# Altium schematic sheet MCU025A_XDS110_Target_Interface.SchDoc
size 431 x 279 mm; Date: Not shown in title block; ApprovedBy: Not shown in title block; CheckedBy: Not shown in title block; Author: Not shown in title block; CompanyName: Not shown in title block; Engineer: Not shown in title block; Organization: Not shown in title block; Address1: Not shown in title block; Address2: Not shown in title block; Address3: Not shown in title block; Address4: Not shown in title block; DocumentNumber: 5; Revision: Use project parameter SCH_Rev; SheetNumber: 5; SheetTotal: 8; PageSetup: Record=PageOptions|CenterHorizontal=True|CenterVertical=True|PrintScale=1.00|XCorrection=1.00|YCorrection=1.00|PrintKind=0|BorderSize=5000000|LeftOffset=0|BottomOffset=0|Orientation=2|PaperLength=1000|PaperWidth=1000|Scale=100|PaperSource=15|PrintQuality=600|MediaType=1|DitherType=10|PaperKind=Letter|PrintScaleMode=1; CurrentTime: Not shown in title block; CurrentDate: Not shown in title block; Time: Not shown in title block; DocumentFullPathAndName: Not shown in title block; DocumentName: Not shown in title block; ModifiedDate: Not shown in title block; ImagePath: Not shown in title block
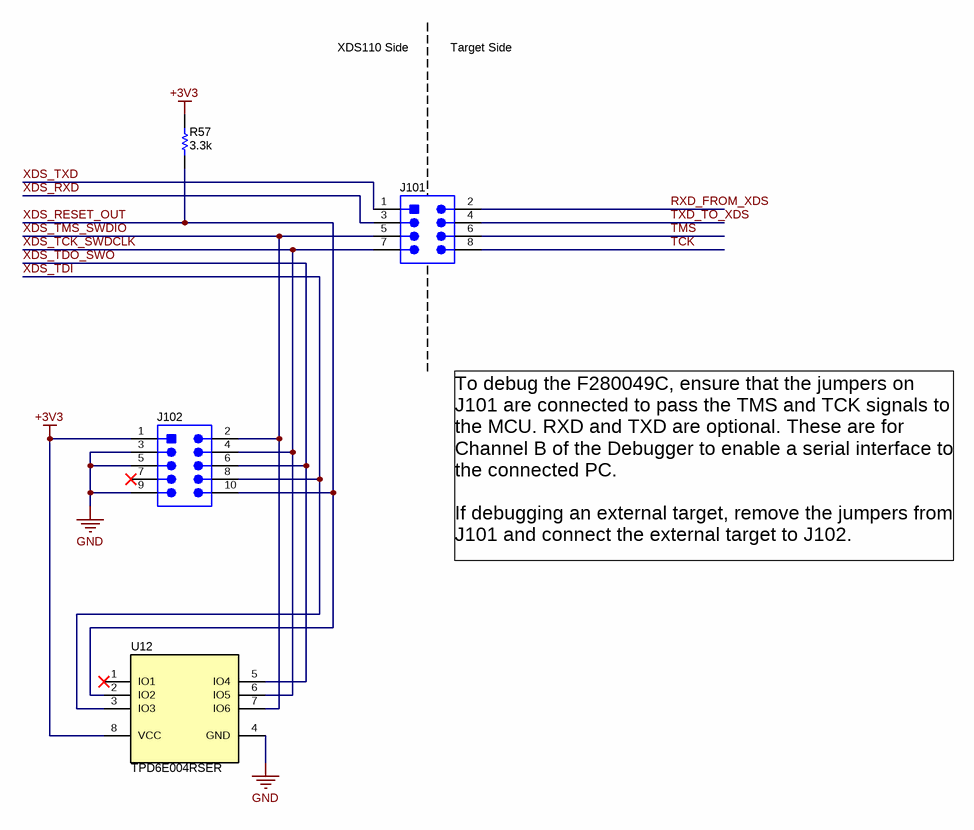
[diagram p0: MCU025A_XDS110_Target_Interface.SchDoc]

## Parts
J101  TSW-104-07-G-D  [TSW-104-07-G-D]  (value not drawn)
J102  FTSH-105-01-F-DV-K  [Samtec_FTSH-105-01-x-DV-K]  (value not drawn)
R57  ValueDisplayed: 3.3k  [0402]  (hidden comment: CRCW04023K30JNED)
U12  TPD6E004RSER  [RSE0008A]

## Nets
+3V3: J102.1 R57.2 U12.8(VCC)
GND: J102.3 J102.5 J102.9 U12.4(GND)
RXD_FROM_XDS: J101.2
TCK: J101.8
TMS: J101.6
TXD_TO_XDS: J101.4
XDS_RESET_OUT: J102.10 R57.1 U12.2(IO2)
XDS_RXD: J101.3
XDS_TCK_SWDCLK: J101.7 J102.4 U12.6(IO5)
XDS_TDI: J102.8 U12.3(IO3)
XDS_TDO_SWO: J102.6 U12.5(IO4)
XDS_TMS_SWDIO: J101.5 J102.2 U12.7(IO6)
XDS_TXD: J101.1

Not connected (* = marked no-connect by the designer): J102 7*; U12 1(IO1)*

## Notes on the sheet
- XDS110 Side
- Target Side
- To debug the F280049C, ensure that the jumpers on J101 are connected to pass the TMS and TCK signals to the MCU. RXD and TXD are optional. These are for Channel B of the Debugger to enable a serial interface to the connected PC.
  If debugging an external target, remove the jumpers from J101 and connect the external target to J102.
- Drawn By:
- SVN Rev:
- Number:
- TID #:
- Orderable:
- Rev:
- Sheet Title:
- File:
- Project Title:
- Designed for:
- Assembly Variant:
- Mod. Date:
- Sheet:
- Size:
- of
- B
- http://www.ti.com
- Texas Instruments and/or its licensors do not warrant the accuracy or completeness of this specification or any information contained therein. Texas Instruments and/or its licensors do not warrant that this design will meet the specifications, will be suitable for your application or fit for any particular purpose, or will operate in an implementation. Texas Instruments and/or its licensors do not warrant that the design is production worthy. You should completely validate and test your design implementation to confirm the system functionality for your application.
- Engineer:
- Contact:
- © Texas Instruments

## Library data of the parts
J101 = CMP-0075408-1: Header, 100mil, 4x2, Gold, TH; Manufacturer: Samtec; Pitch_mm: 2.54; Cert_VDE: N; Gender: Male; Cert_CSA: Y; Voltage_V: 550V; Green_REACh: Passed; Current_A: 6.3A; CT: False; Green_Lifecycle: Active; Row_Count: 2; CNHeader: True; ComponentLink1Description: Datasheet URL; RoHS: Y; Supplier 1: Digi-Key; Cert_UL: Y; Orientation: Vertical; Green_EU RoHS: Passed; PackageReference: 4x2 Header; Color: Black; PartNumber: TSW-104-07-G-D; PinCount: 8; Publisher: Texas Instruments; ContactFinish: Gold; Cert_CULUS: N; Shrouded: N; ClassName: Header; RowSpacing_mm: 2.54; ComponentLink1URL: http://samtec.com/ftppub/pdf/TSW_TH.PDF; LatestRevisionDate: 2017-07-12; CompType: Header; MountType: TH; Supplier Part Number 1: SAM1028-04-ND; Green_EU RoHS-2: Passed
J102 = CMP-0075670-1: Header (Shrouded), 1.27mm, 5x2, Gold, SMT; Manufacturer: Samtec; Pitch_mm: 1.27; Gender: Male; Shrouded: Y; Row_Count: 2; Current_A: 3.3A; CNHeader: False; PartNumber: FTSH-105-01-F-DV-K; PackageReference: Header(Shrouded), 1.27mm, 5x2, SMT; CompType: Header; RoHS: Y; MountType: SMT; ComponentLink1Description: Datasheet URL; ComponentLink1URL: http://suddendocs.samtec.com/prints/ftsh-1xx-xx-xxx-dv-xxx-mkt.pdf; Orientation: Vertical; PinCount: 10; RowSpacing_mm: 1.27; ContactFinish: Gold; Color: Black; Cert_CSA: Y; Cert_UL: Y; Publisher: Texas Instruments; LatestRevisionDate: 2017-07-12; Supplier 1: Digi-Key; Supplier Part Number 1: SAM8796-ND; Supplier 2: Newark; Supplier Part Number 2: 45P5160; CT: False
R57 = CMP-0026918-5: RES, 3.3 k, 5%, 0.063 W, AEC-Q200 Grade 0, 0402; Manufacturer: Vishay-Dale; Value: 3.3k; Value_Code: 3k30; Power_W: 63mW; Value2: 0.063W; VDC_V: 50V; TempCo: 200 ppm/C; SizeArea_mm2: 0.5; SizeX_mm: 1; SizeZ_mm: 0.6; EIA_Code: E24; AEC Category: Q200; AEC Qualified: Y; AEC Grade: 0; CompType: Resistor; PartNumber: CRCW04023K30JNED; PackageReference: 0402; RoHS: E; Res_ohm: 3.3k; Tolerance_%: 5%; Value1: 5%; MountType: SMT; Technology: Thick Film; SizeY_mm: 0.5; ComponentLink1Description: Datasheet link; ComponentLink1URL: http://www.vishay.com/docs/20035/dcrcwe3.pdf; Supplier 1: Digi-Key; Supplier Part Number 1: 541-3.3KJCT-ND; Supplier 2: Newark; Supplier Part Number 2: 59M6723; Supplier 3: Mouser; Supplier Part Number 3: 71-CRCW0402J-3.3K-E3
U12 = CMP-0043125-2: Low-Capacitance + / - 15 kV ESD Protection Array for High-Speed Data Interfaces, 6 Channels, -40 to +85 degC, 8-pin UQFN (RSE), Green (RoHS & no Sb/Br); Manufacturer: Texas Instruments; 1394 / Firewire: TRUE; Breakdown Voltage(Min)(V): 6; IEC 61000-4-2 Air-Gap(+/- kV): 12; IEC 61000-4-2 Contact(+/- kV): 8; IO Capacitance(Typ)(pF): 1.6; IO Leakage Current(nA): 1; SubFamily: ESD Solution; DatasheetVersion: SLLS799A; PackageVersion: revD, Jan-2011; PackageReference: RSE0008A; PackageDescription: 8-Pin Plastic Quad Flatpack No-Lead, 1.5 x 1.5 mm Body, 0.5 mm Pitch; Eco-Plan: Green (RoHS & no Sb/Br); Serial ATA / eSATA: TRUE; USB High Speed: TRUE; PartNumber: TPD6E004RSER; ComponentLink1Description: Manufacturer URL; ComponentLink1URL: http://www.ti.com/; ComponentLink2Description: Datasheet; ComponentLink2URL: http://www.ti.com/general/docs/lit/getliterature.tsp?genericPartNumber=TPD6E004&fileType=pdf; ComponentLink3Description: URL Link1; ComponentLink3URL: SamplesURL:http://www.ti.com/product/tpd6e004#samples; Mounting Technology: Surface Mount